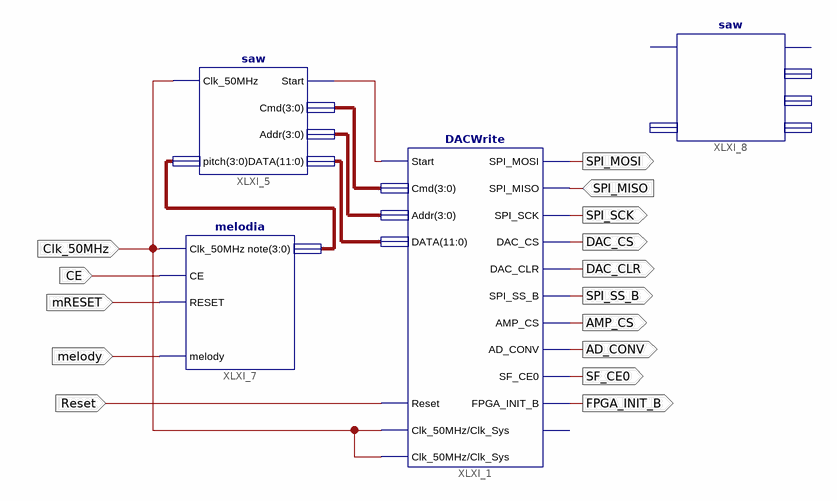
[diagram p0: schematic sheet 1]
// Xilinx ISE schematic connecting.sch (spartan3e) as structural Verilog: 4 symbols, 15 ports
module connecting (
  input  Clk_50MHz,
  input  Reset,
  input  SPI_MISO,
  input  mRESET,
  input  melody,
  input  CE,
  output SPI_MOSI,
  output SPI_SCK,
  output DAC_CS,
  output DAC_CLR,
  output SPI_SS_B,
  output AMP_CS,
  output AD_CONV,
  output SF_CE0,
  output FPGA_INIT_B
);

  wire XLXN_38;
  wire [3:0] XLXN_3, XLXN_4, XLXN_33;
  wire [11:0] XLXN_37;

  DACWrite XLXI_1 (
    .Reset(Reset), .Start(XLXN_38), .SPI_MISO(SPI_MISO), .Cmd(XLXN_3), .Addr(XLXN_4), .DATA(XLXN_37),
    .DAC_CLR(DAC_CLR), .DAC_CS(DAC_CS), .SPI_MOSI(SPI_MOSI), .SPI_SCK(SPI_SCK), .SPI_SS_B(SPI_SS_B),
    .AMP_CS(AMP_CS), .AD_CONV(AD_CONV), .SF_CE0(SF_CE0), .FPGA_INIT_B(FPGA_INIT_B), .Clk_50MHz(Clk_50MHz),
    .Clk_Sys(Clk_50MHz));  // open: Busy
  saw XLXI_5 (.Clk_50MHz(Clk_50MHz), .pitch(XLXN_33), .Start(XLXN_38), .Cmd(XLXN_3), .Addr(XLXN_4), .DATA(XLXN_37));
  melodia XLXI_7 (.Clk_50MHz(Clk_50MHz), .CE(CE), .RESET(mRESET), .note(XLXN_33), .melody(melody));
  saw XLXI_8 ();  // open: Clk_50MHz, pitch, Start, Cmd, Addr, DATA
endmodule
